# Altium schematic sheet FPGA_PWR.SchDoc
size C
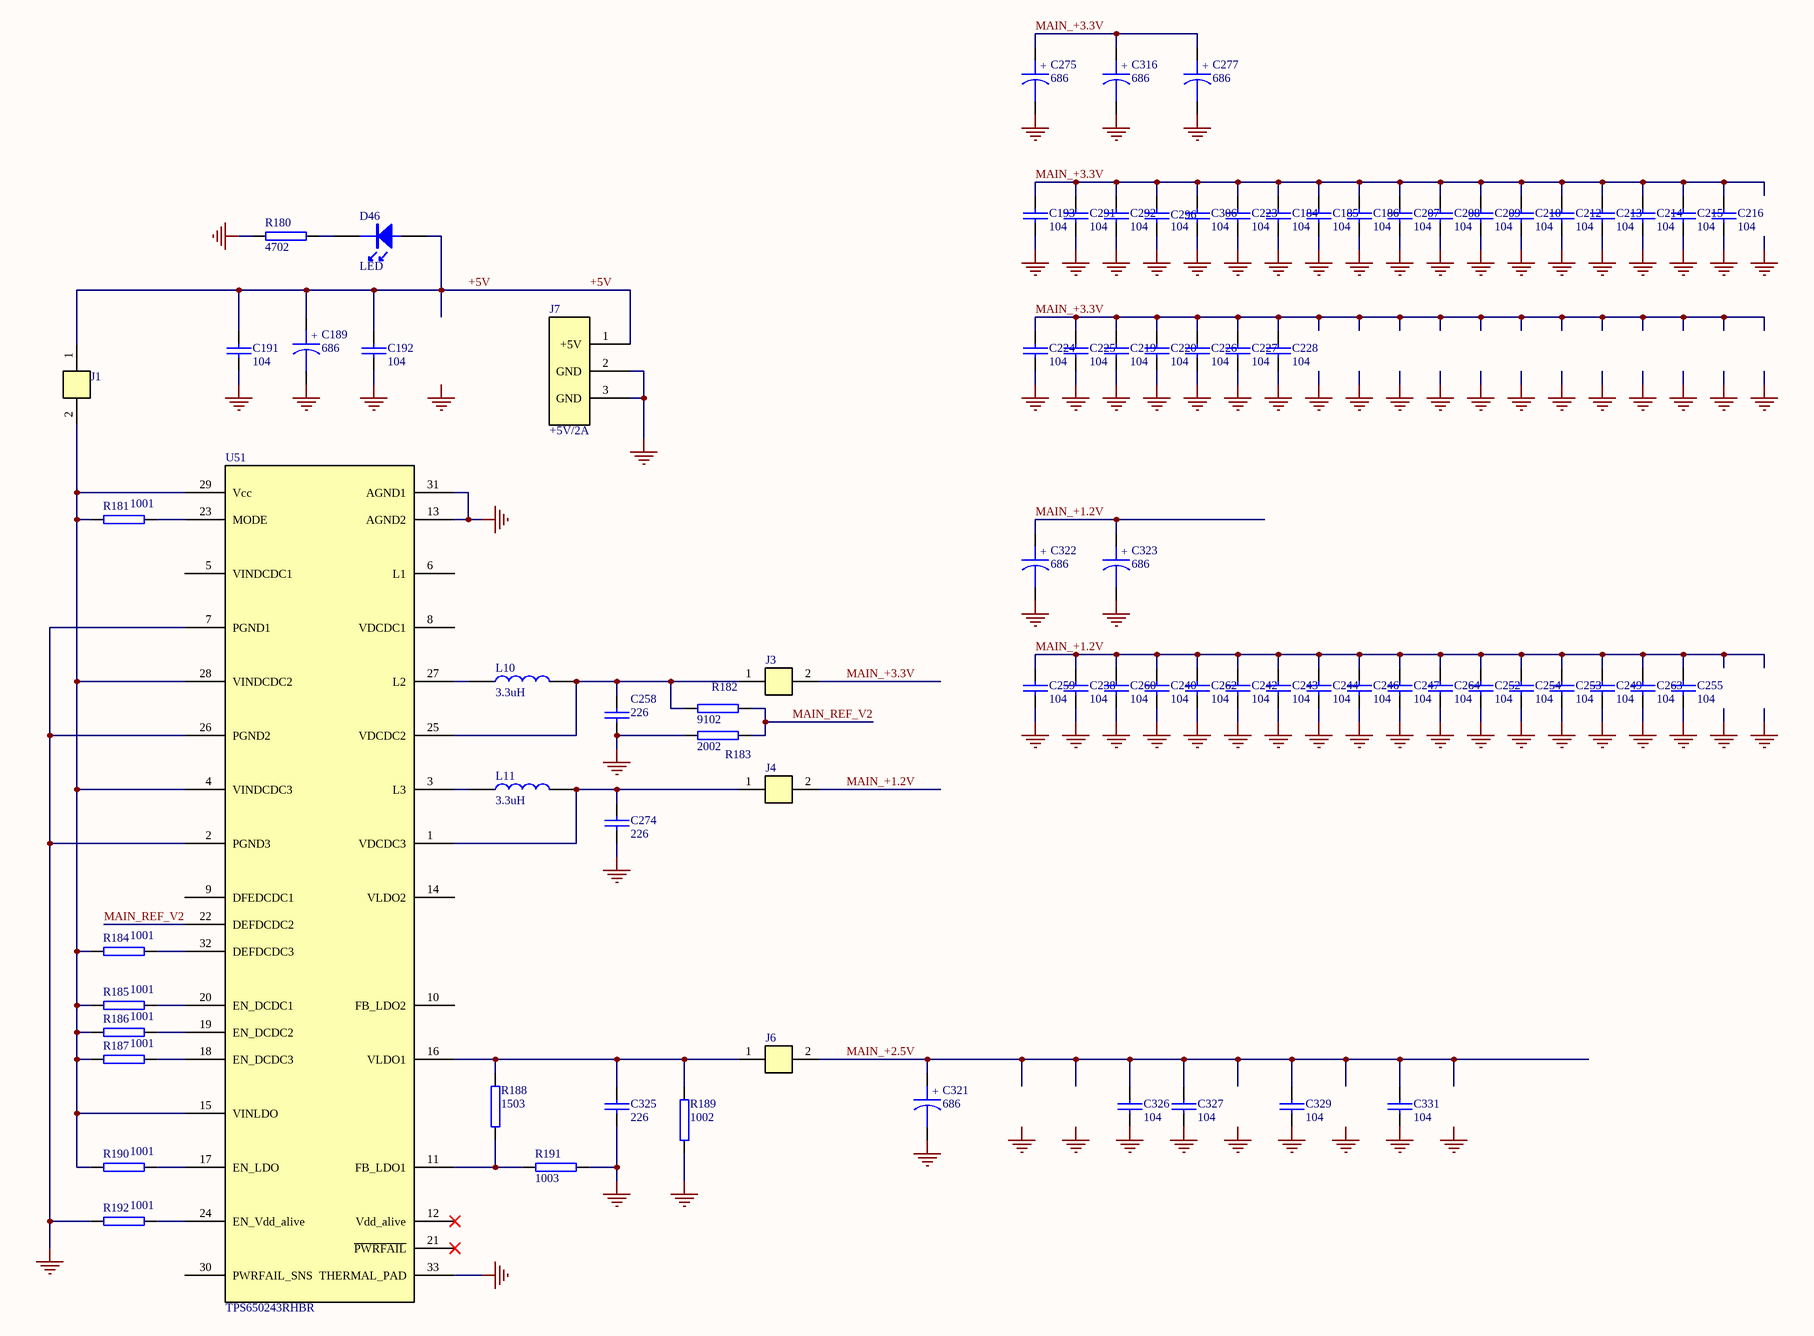
[diagram p0: FPGA_PWR.SchDoc]

## Parts
C184  104  [0402C]
C185  104  [0402C]
C186  104  [0402C]
C189  686  [6032]
C191  104  [0805C]
C192  104  [0805C]
C193  104  [0805-104]
C207  104  [0402C]
C208  104  [0402C]
C209  104  [0402C]
C210  104  [0402C]
C212  104  [0402C]
C213  104  [0402C]
C214  104  [0402C]
C215  104  [0402C]
C216  104  [0402C]
C219  104  [0402C]
C220  104  [0402C]
C223  104  [0402C]
C224  104  [0402C]
C225  104  [0402C]
C226  104  [0402C]
C227  104  [0402C]
C228  104  [0402C]
C238  104  [0402C]
C240  104  [0805-104]
C242  104  [0402C]
C243  104  [0402C]
C244  104  [0402C]
C246  104  [0402C]
C247  104  [0402C]
C249  104  [0402C]
C252  104  [0402C]
C253  104  [0402C]
C254  104  [0402C]
C255  104  [0805-104]
C258  226  [C226]
C259  104  [0402C]
C260  104  [0402C]
C262  104  [0402C]
C263  104  [0402C]
C264  104  [0402C]
C274  226  [C226]
C275  686  [6032]
C277  686  [6032]
C291  104  [0402C]
C292  104  [0402C]
C296  104  [0805C]
C306  104  [0402C]
C316  686  [6032]
C321  686  [6032]
C322  686  [6032]
C323  686  [6032]
C325  226  [C226]
C326  104  [0402C]
C327  104  [0402C]
C329  104  [0402C]
C331  104  [0402C]
D46  LED  [0805_LED]
J1  (no value)  [I_ON]
J3  (no value)  [I_ON]
J4  (no value)  [I_ON]
J6  (no value)  [I_ON]
J7  +5V/2A  [POW]
L10  3.3uH  [L3R3]
L11  3.3uH  [L3R3]
R180  4702  [0805R]
R181  1001  [0805R]
R182  9102  [0805]
R183  2002  [0805]
R184  1001  [0805]
R185  1001  [0805]
R186  1001  [0805]
R187  1001  [0805]
R188  1503  [0805]
R189  1002  [0805]
R190  1001  [0805]
R191  1003  [0805]
R192  1001  [0805]
U51  TPS650243RHBR  [VQFN32]

## Nets
DGND: C184.1 C185.1 C186.1 C189.2 C191.1 C192.1 C193.1 C207.1 C208.1 C209.1 C210.1 C212.1 C213.1 C214.1 C215.1 C216.1 C219.1 C220.1 C223.1 C224.1 C225.1 C226.1 C227.1 C228.1 C238.1 C240.1 C242.1 C243.1 C244.1 C246.1 C247.1 C249.1 C252.1 C253.1 C254.1 C255.1 C258.2 C259.1 C260.1 C262.1 C263.1 C264.1 C274.2 C275.2 C277.2 C291.1 C292.1 C296.1 C306.1 C316.2 C321.2 C322.2 C323.2 C325.2 C326.1 C327.1 C329.1 C331.1 J7.2(GND) J7.3(GND) R180.1 R183.2 R189.2 R191.2 R192.1 U51.2(PGND3) U51.7(PGND1) U51.13(AGND2) U51.26(PGND2) U51.31(AGND1) U51.33(THERMAL_PAD)
+5V: C189.1 C191.2 C192.2 D46.1(A) J1.1 J7.1(+5V)
MAIN_+1.2V: C238.2 C240.2 C242.2 C243.2 C244.2 C246.2 C247.2 C249.2 C252.2 C253.2 C254.2 C255.2 C259.2 C260.2 C262.2 C263.2 C264.2 C322.1 C323.1 J4.2
MAIN_+2.5V: C321.1 C326.2 C327.2 C329.2 C331.2 J6.2
MAIN_+3.3V: C184.2 C185.2 C186.2 C193.2 C207.2 C208.2 C209.2 C210.2 C212.2 C213.2 C214.2 C215.2 C216.2 C219.2 C220.2 C223.2 C224.2 C225.2 C226.2 C227.2 C228.2 C275.1 C277.1 C291.2 C292.2 C296.2 C306.2 C316.1 J3.2
MAIN_REF_V2: R182.2 R183.1 U51.22(DEFDCDC2)
NetC258_1: C258.1 J3.1 L10.2 R182.1 U51.25(VDCDC2)
NetC274_1: C274.1 J4.1 L11.2 U51.1(VDCDC3)
NetC325_1: C325.1 J6.1 R188.2 R189.1 U51.16(VLDO1)
NetD46_2: D46.2(K) R180.2
NetJ1_2: J1.2 R181.1 R184.1 R185.1 R186.1 R187.1 R190.1 U51.4(VINDCDC3) U51.15(VINLDO) U51.28(VINDCDC2) U51.29(Vcc)
NetL10_1: L10.1 U51.27(L2)
NetL11_1: L11.1 U51.3(L3)
NetR181_2: R181.2 U51.23(MODE)
NetR184_2: R184.2 U51.32(DEFDCDC3)
NetR185_2: R185.2 U51.20(EN_DCDC1)
NetR186_2: R186.2 U51.19(EN_DCDC2)
NetR187_2: R187.2 U51.18(EN_DCDC3)
NetR188_1: R188.1 R191.1 U51.11(FB_LDO1)
NetR190_2: R190.2 U51.17(EN_LDO)
NetR192_2: R192.2 U51.24(EN_Vdd_alive)

Not connected (* = marked no-connect by the designer): U51 5(VINDCDC1) 6(L1) 8(VDCDC1) 9(DFEDCDC1) 10(FB_LDO2) 12(Vdd_alive)* 14(VLDO2) 21(~{PWRFAIL})* 30(PWRFAIL_SNS)

## Notes on the sheet
- Labels drawn without touching a wire or pin: DGND
- (in symbol CAPACITOR POL) +

## Library data of the parts
C184-C186 C191-C193 C207-C210 C212-C216 C219 C220 C223-C228 C238 C240 C242-C244 C246 C247 C249 C252-C255 C258-C260 C262-C264 C274 C291 C292 C296 C306 C325-C327 C329 C331 = CAP: Capacitor
C189 C275 C277 C316 C321-C323 = CAPACITOR POL: Capacitor
J1 J3 J4 J6 = I_ON
J7 = POW
L10 L11 = L
R180-R192 = RES2
U51 = TPS650243